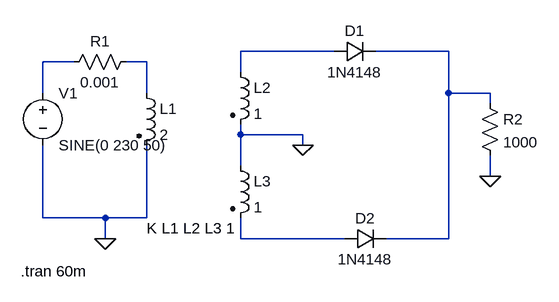
[diagram p0: schematic Full wave rectifier without filter.asc]
Full wave rectifier without filter.asc, the LTspice schematic file:
Version 4
SHEET 1 880 680
WIRE 464 64 320 64
WIRE 640 64 528 64
WIRE 64 80 16 80
WIRE 176 80 144 80
WIRE 320 96 320 64
WIRE 16 128 16 80
WIRE 176 128 176 80
WIRE 640 128 640 64
WIRE 704 128 640 128
WIRE 704 144 704 128
WIRE 320 192 320 176
WIRE 416 192 320 192
WIRE 416 208 416 192
WIRE 320 240 320 192
WIRE 704 256 704 224
WIRE 16 320 16 208
WIRE 112 320 16 320
WIRE 176 320 176 208
WIRE 176 320 112 320
WIRE 112 352 112 320
WIRE 320 352 320 320
WIRE 480 352 320 352
WIRE 640 352 640 128
WIRE 640 352 544 352
FLAG 704 256 0
FLAG 112 352 0
FLAG 416 208 0
SYMBOL voltage 16 112 R0
WINDOW 123 0 0 Left 0
WINDOW 39 0 0 Left 0
SYMATTR InstName V1
SYMATTR Value SINE(0 230 50)
SYMBOL ind2 160 112 R0
SYMATTR InstName L1
SYMATTR Value 2
SYMATTR Type ind
SYMBOL ind2 304 80 R0
SYMATTR InstName L2
SYMATTR Value 1
SYMATTR Type ind
SYMBOL ind2 304 224 R0
SYMATTR InstName L3
SYMATTR Value 1
SYMATTR Type ind
SYMBOL diode 464 80 R270
WINDOW 0 32 32 VTop 2
WINDOW 3 0 32 VBottom 2
SYMATTR InstName D1
SYMATTR Value 1N4148
SYMBOL diode 480 368 R270
WINDOW 0 32 32 VTop 2
WINDOW 3 0 32 VBottom 2
SYMATTR InstName D2
SYMATTR Value 1N4148
SYMBOL res 160 64 R90
WINDOW 0 0 56 VBottom 2
WINDOW 3 32 56 VTop 2
SYMATTR InstName R1
SYMATTR Value 0.001
SYMBOL res 688 128 R0
SYMATTR InstName R2
SYMATTR Value 1000
TEXT 176 336 Left 2 !K L1 L2 L3 1
TEXT -18 402 Left 2 !.tran 60m

The netlist it stands for:
* Full wave rectifier without filter.asc
V1 N003 0 SINE(0 230 50)
L1 N004 0 2
L2 N001 0 1
L3 0 N005 1
D1 N001 N002 1N4148
D2 N005 N002 1N4148
R1 N004 N003 0.001
R2 N002 0 1000
.model D D
.lib standard.dio
K L1 L2 L3 1
.tran 60m
.backanno
.end